# EAGLE design DIY_OpenEVSE_PLUS (EAGLE 6.4)
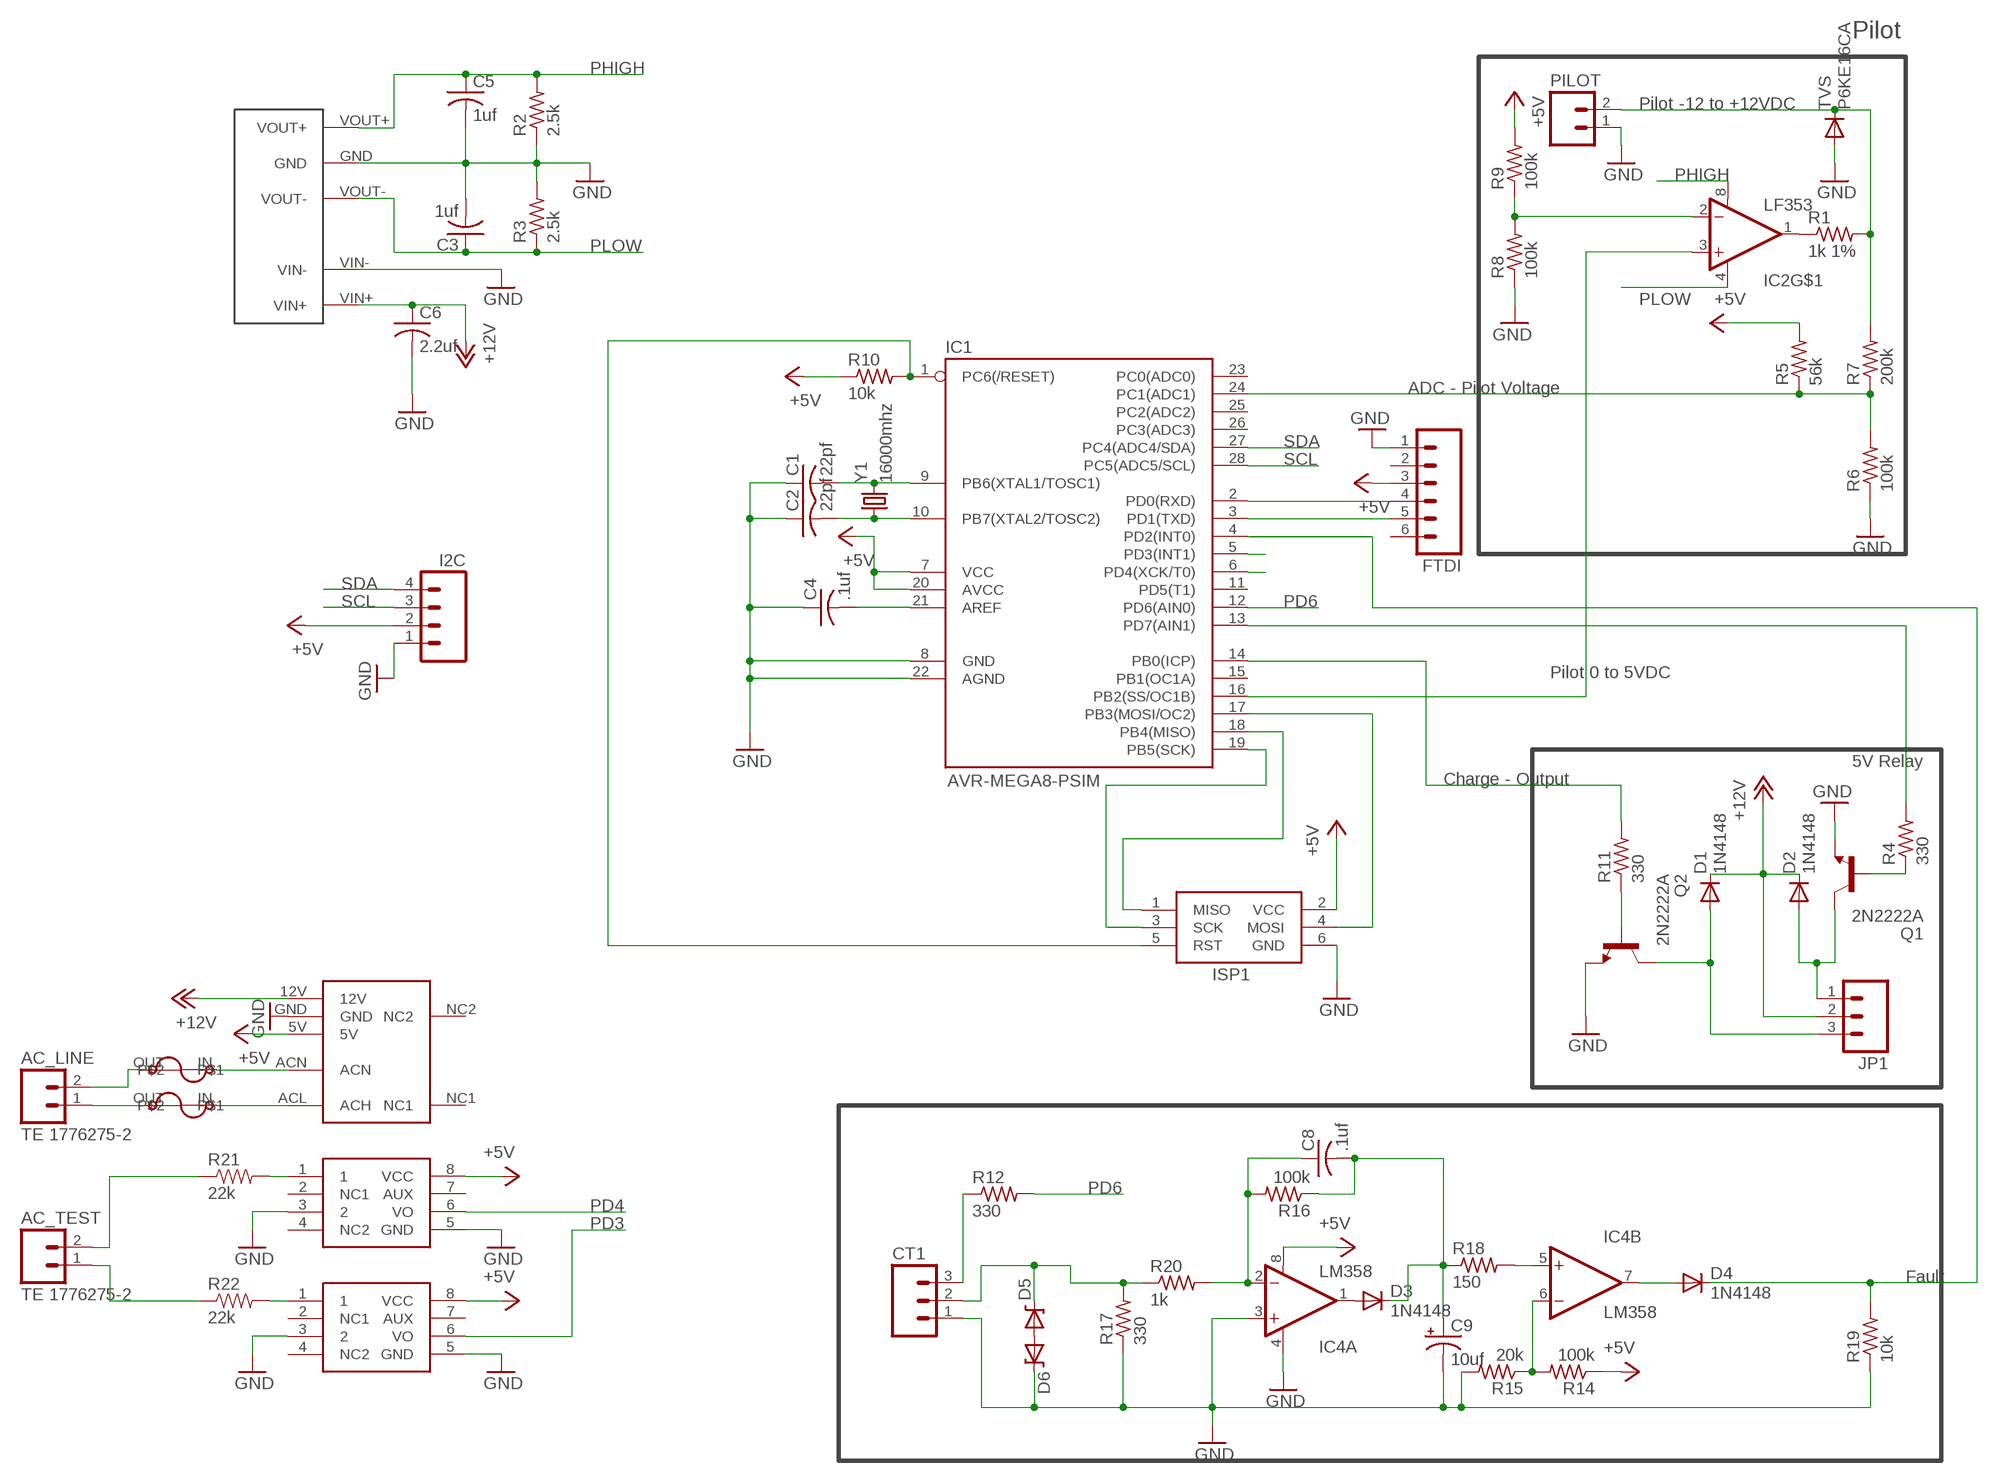
[diagram p0: schematic, sheet 1]

## Parts
AC_LINE  TE 1776275-2  M023.5MM_LOCK  [SCREWTERMINAL-3.5MM-2_LOCK]
AC_TEST  TE 1776275-2  M023.5MM_LOCK  [SCREWTERMINAL-3.5MM-2_LOCK]
C1  22pf  C-US025-024X044  [C025-024X044]
C2  22pf  C-US025-024X044  [C025-024X044]
C3  1uf  C-US025-024X044  [C025-024X044]
C4  .1uf  C-US025-024X044  [C025-024X044]
C5  1uf  C-US025-024X044  [C025-024X044]
C6  2.2uf  C-US025-024X044  [C025-024X044]
C8  .1uf  C-US025-024X044  [C025-024X044]
C9  10uf  CAP_POLPTH2  [CPOL-RADIAL-10UF-25V]
CT1  M03LOCK  [1X03_LOCK]
D1  1N4148  DIODE1N4148  [DIODE-1N4148]
D2  1N4148  DIODE1N4148  [DIODE-1N4148]
D3  1N4148  DIODE1N4148  [DIODE-1N4148]
D4  1N4148  DIODE1N4148  [DIODE-1N4148]
D5  DIODE-ZENERPTH  [DIODE-ZENER]
D6  DIODE-ZENERPTH  [DIODE-ZENER]
DCDC  D107E  DCDC_SIP  [DCDC_SIP]
FTDI  M06LOCK  [1X06_LOCK]
I2C  M04LOCK  [1X04_LOCK]
IC1  AVR-MEGA8-PSIM  [DIL28-3-SIMON]
IC2  LF353  LM358  [DIP08]
IC3  MID400  [DIP08]
IC4  LM358  OPAMP-DUALDIP  [DIP08]
IC5  MID400  [DIP08]
ISP1  AVRISP-6  [AVRISP]
JP1  M03SCREW_LOCK  [SCREWTERMINAL-3.5MM-3_LOCK.007S]
PILOT  M025MM  [SCREWTERMINAL-5MM-2]
Q1  2N2222A  [TO18]
Q2  2N2222A  [TO18]
R1  1k 1%  R-US_0204/7  [0204/7]
R2  2.5k  R-US_0204/7  [0204/7]
R3  2.5k  R-US_0204/7  [0204/7]
R4  330  R-US_0204/7  [0204/7]
R5  56k  R-US_0204/7  [0204/7]
R6  100k  R-US_0204/7  [0204/7]
R7  200k  R-US_0204/7  [0204/7]
R8  100k  R-US_0204/7  [0204/7]
R9  100k  R-US_0204/7  [0204/7]
R10  10k  R-US_0204/7  [0204/7]
R11  330  R-US_0204/7  [0204/7]
R12  330  R-US_0204/7  [0204/7]
R14  100k  R-US_0204/7  [0204/7]
R15  20k  R-US_0204/7  [0204/7]
R16  100k  R-US_0204/7  [0204/7]
R17  330  R-US_0204/7  [0204/7]
R18  150  R-US_0204/7  [0204/7]
R19  10k  R-US_0204/7  [0204/7]
R20  1k  R-US_0204/7  [0204/7]
R21  22k  RESISTORPTH-1/4W  [AXIAL-0.4]
R22  22k  RESISTORPTH-1/4W  [AXIAL-0.4]
TVS  P6KE16CA  DIODEPTH  [DIODE-1N4001]
U$3  BEL1AFUSE  [BELFUSE1A]
U$4  MPM-04E-1205  [MPM-04E-1205]
U$5  BEL1AFUSE  [BELFUSE1A]
Y1  16000mhz  CRYSTALHC49UV  [HC49U-V]

## Nets
+5V: FTDI.3 I2C.2 IC1.7(VCC) IC1.20(AVCC) IC3.8(VCC) IC4.8(A:V+) IC5.8(VCC) ISP1.2(VCC) R5.2 R9.2 R10.1 R14.1 U$4.5V
+12V: C6.1 D1.C D2.C DCDC.VIN+ JP1.2 U$4.12V
GND: C1.1 C2.1 C3.2 C4.1 C5.2 C6.2 C9.2(-) CT1.1 D6.P$1(C) DCDC.GND DCDC.VIN- FTDI.1 I2C.1 IC1.8(GND) IC1.22(AGND) IC3.3 IC3.5(GND) IC4.3(A:+IN) IC4.4(A:V-) IC5.3 IC5.5(GND) ISP1.6(GND) PILOT.1 Q1.1(E) Q2.1(E) R2.1 R3.2 R6.1 R8.1 R15.2 R17.1 R19.1 TVS.A U$4.GND
N$1: AC_LINE.1 U$3.OUT
N$2: Q2.2(B) R11.1
N$3: PILOT.2 R1.2 R7.2 TVS.C
N$4: C1.2 IC1.9(PB6(XTAL1/TOSC1)) Y1.2
N$5: C2.2 IC1.10(PB7(XTAL2/TOSC2)) Y1.1
N$6: AC_LINE.2 U$5.OUT
N$7: C4.2 IC1.21(AREF)
N$8: FTDI.5 IC1.3(PD1(TXD))
N$9: IC3.1 R21.P$2
N$10: IC2.2(-IN) R8.2 R9.1
N$11: IC2.1(OUT) R1.1
N$12: FTDI.4 IC1.2(PD0(RXD))
N$13: D1.A JP1.3 Q2.3(C)
N$14: IC1.17(PB3(MOSI/OC2)) ISP1.4(MOSI)
N$15: IC1.19(PB5(SCK)) ISP1.3(SCK)
N$16: IC1.18(PB4(MISO)) ISP1.1(MISO)
N$17: IC5.1 R22.P$2
N$18: C8.1 IC4.2(A:-IN) R16.2 R20.2
N$19: IC4.5(B:+IN) R18.2
N$20: CT1.2 D5.P$1(C) R17.2 R20.1
N$21: D3.A IC4.1(A:OUT)
N$22: D5.P$2(A) D6.P$2(A)
N$23: C8.2 C9.1(+) D3.C R16.1 R18.1
N$24: IC4.6(B:-IN) R14.2 R15.1
N$25: D4.A IC4.7(B:OUT)
N$26: AC_TEST.2 R21.P$1
N$27: U$3.IN U$4.ACL(ACH)
N$28: D4.C IC1.4(PD2(INT0)) R19.2
N$29: AC_TEST.1 R22.P$1
N$30: U$4.ACN U$5.IN
N$31: Q1.2(B) R4.1
N$32: D2.A JP1.1 Q1.3(C)
N$33: IC1.13(PD7(AIN1)) R4.2
N$34: IC1.14(PB0(ICP)) R11.2
N$35: CT1.3 R12.1
N$53: IC1.24(PC1(ADC1)) R5.1 R6.2 R7.1
PD3: IC1.5(PD3(INT1)) IC5.6(VO)
PD4: IC1.6(PD4(XCK/T0)) IC3.6(VO)
PD6: IC1.12(PD6(AIN0)) R12.2
PHIGH: C5.1 DCDC.VOUT+ IC2.8(V+) R2.2
PLOW: C3.1 DCDC.VOUT- IC2.4(V-) R3.1
RST: IC1.1(PC6(/RESET)) ISP1.5(RST) R10.2
S$2: IC1.16(PB2(SS/OC1B)) IC2.3(+IN)
SCL: I2C.3 IC1.28(PC5(ADC5/SCL))
SDA: I2C.4 IC1.27(PC4(ADC4/SDA))
Unconnected: FTDI.2 FTDI.6 IC1.11(PD5(T1)) IC1.15(PB1(OC1A)) IC1.23(PC0(ADC0)) IC1.25(PC2(ADC2)) IC1.26(PC3(ADC3)) IC2.5(+IN) IC2.6(-IN) IC2.7(OUT) IC3.2(NC1) IC3.4(NC2) IC3.7(AUX) IC5.2(NC1) IC5.4(NC2) IC5.7(AUX) U$4.NC1 U$4.NC2

## Notes on the sheet
- Pilot
- Pilot -12 to +12VDC
- ADC - Pilot Voltage
- Pilot 0 to 5VDC
- 5V Relay
- Charge - Output
- Fault

## Library data of the parts
AC_LINE AC_TEST PILOT = SparkFun:M02: Header 2 Standard 2-pin 0.1" header. Use with straight break away headers (SKU : PRT-00116), right angle break away headers (PRT-00553), swiss pins (PRT-00743), machine pins (PRT-00117), and female headers (PRT-00115). Molex polarized connector foot print use with SKU : PRT-08233 with associated crimp pins and housings.
C1-C6 C8 = adafruit:C-US: CAPACITOR, American symbol
C9 = SparkFun:CAP_POL: Capacitor Polarized These are standard SMD and PTH capacitors. Normally 10uF, 47uF, and 100uF in electrolytic and tantalum varieties. Always verify the external diameter of the through hole cap, it varies with capacity, voltage, and manufacturer. The EIA devices should be standard.
CT1 JP1 = SparkFun:M03: Header 3 Standard 3-pin 0.1" header. Use with straight break away headers (SKU : PRT-00116), right angle break away headers (PRT-00553), swiss pins (PRT-00743), machine pins (PRT-00117), and female headers (PRT-00115). Molex polarized connector foot print use with SKU : PRT-08232 with associated crimp pins and housings.
D1-D4 TVS = SparkFun:DIODE: Diode These are standard reverse protection diodes and small signal diodes. SMA package can handle up to about 1A. SOD-323 can handle about 200mA. What the SOD-323 package when ordering, there are some mfgs out there that are 5-pin packages.
D5 D6 = SparkFun:DIODE-ZENER: Zener Diode Production Part - 8199 3.4V Zener Voltage
DCDC = Qxd:DCDC_SIP
FTDI = SparkFun:M06: Header 6 Standard 6-pin 0.1" header. Use with straight break away headers (SKU : PRT-00116), right angle break away headers (PRT-00553), swiss pins (PRT-00743), machine pins (PRT-00117), and female headers (PRT-00115). Molex polarized connector foot print use with SKU : PRT-08094 with associated crimp pins and housings. NOTES ON THE VARIANTS LOCK and LOCK_LONGPADS... This footprint was designed to help hold the alignment of a through-hole component (i.e. 6-pin header) while soldering it into place. You may notice that each hole has been shifted either up or down by 0.005 of an inch from it's more standard position (which is a perfectly straight line). This slight alteration caused the pins (the squares in the middle) to touch the edges of the holes. Because they are alternating, it causes a "brace" to hold the component in place. 0.005 has proven to be the perfect amount of "off-center" position when using our standard breakaway headers. Although looks a little odd when you look at the bare footprint, once you have a header in there, the alteration is very hard to notice. Also, if you push a header all the way into place, it is covered up entirely on the bottom side. This idea of altering the position of holes to aid alignment will be further integrated into the Sparkfun Library for other footprints. It can help hold any component with 3 or more connection pins.
I2C = SparkFun:M04: Header 4 Standard 4-pin 0.1" header. Use with straight break away headers (SKU : PRT-00116), right angle break away headers (PRT-00553), swiss pins (PRT-00743), machine pins (PRT-00117), and female headers (PRT-00115). Molex polarized connector foot print use with SKU : PRT-08231 with associated crimp pins and housings.
IC1 = SparkFun:AVR-MEGA8-P: MICROCONTROLLER 8 Kbytes FLASH 1 kbytes SRAM 512 bytes EEPROM USART 4-channel 10 bit ADC 2-channel 8 bit ADC
IC2 = SparkFun:LM358
IC3 IC5 = SparkFun:MID400
IC4 = SparkFun:OPAMP-DUAL: Operational Amplifier
ISP1 = adafruit:AVRISP: AVR ISP HEADER Standard 6 pin header for AVR programming
Q1 Q2 = transistor-npn:2N2222*: NPN Transistor
R1-R12 R14-R20 = adafruit:R-US_: RESISTOR, American symbol
R21 R22 = SparkFun:RESISTOR: Resistor Basic schematic elements and footprints for 0603, 1206, and PTH resistors.
U$3 U$5 = Qxd:BEL1AFUSE
U$4 = Qxd:MPM-04E-1205
Y1 = SparkFun:CRYSTAL: Crystals Various standard crystals. Proven footprints. Spark Fun Electronics SKU : COM-00534

## Board
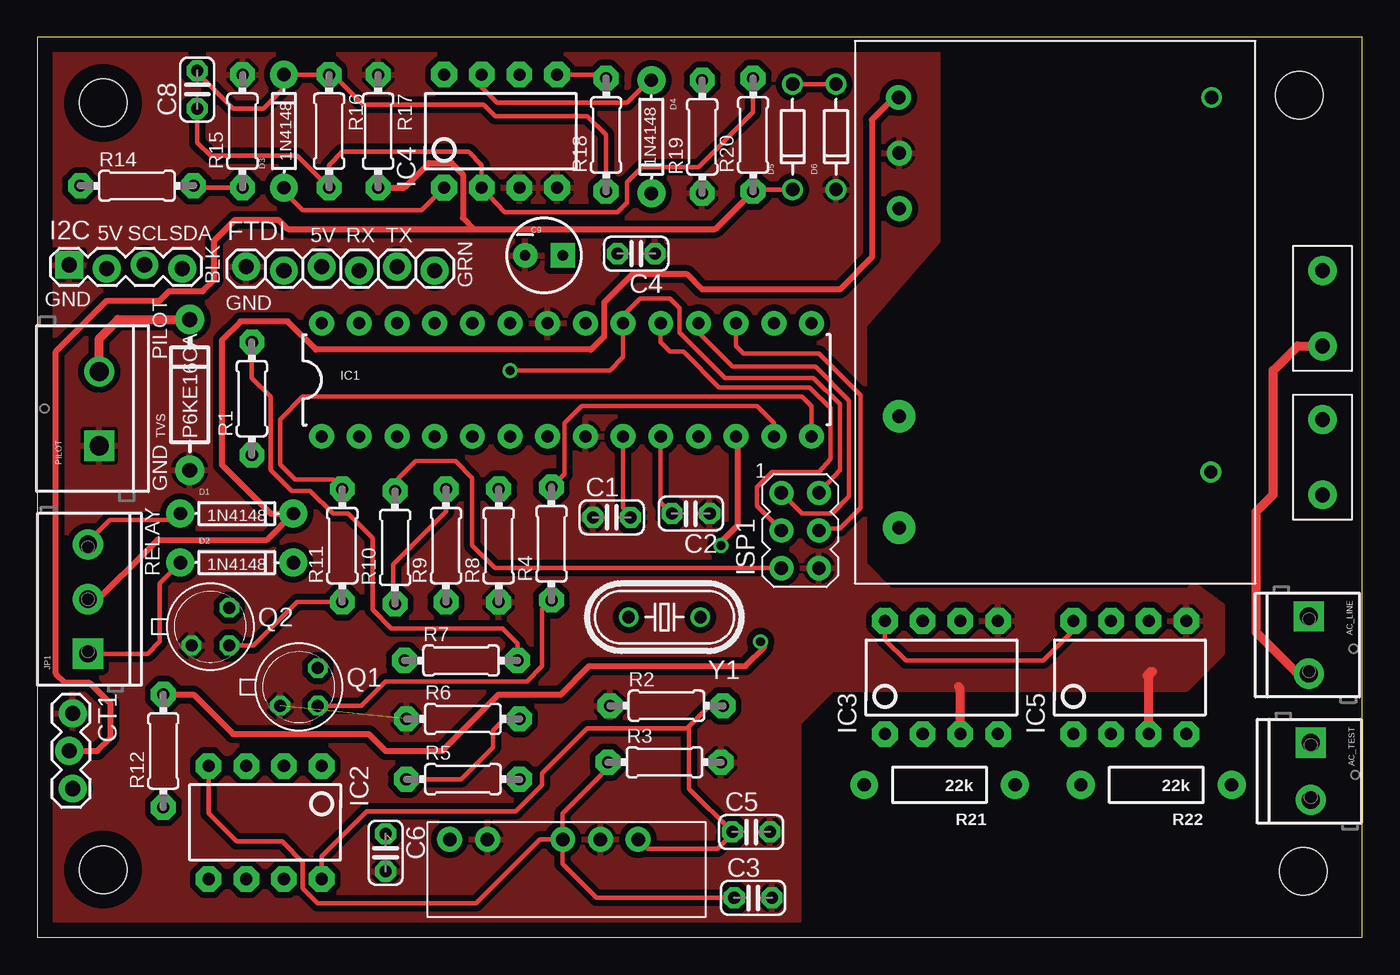
[diagram p1: board, top side]
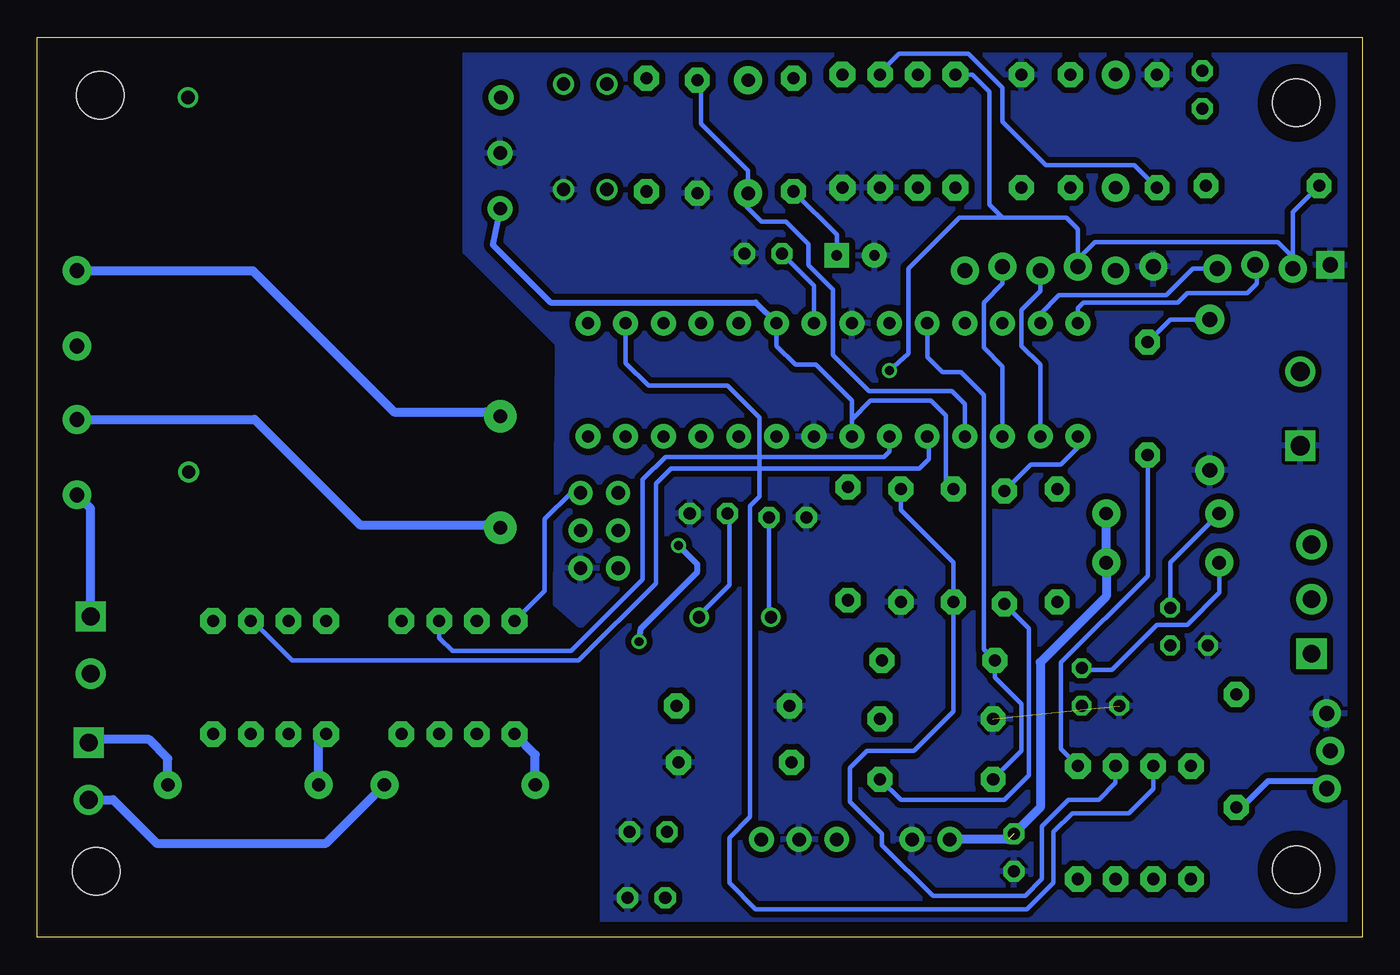
[diagram p2: board, bottom side, seen from below]

Size 89.33 x 60.7 mm. Coordinates in mm from the lower left corner, seen from the top.
Outline: 0,0 89.33,0 89.33,60.7 0,60.7 0,0
Copper layers (1*16): Top 0.035mm / dielectric 1.5mm / Bottom 0.035mm
Design rules "default": minimum track width 10mil, minimum drill 24mil, track to track 8mil, track to pad 8mil, pad to pad 8mil, via to via 8mil, smd to smd 8mil, copper to edge 40mil, drill to drill 8mil, minimum pad ring 10mil, minimum via ring 8mil, stop-mask expansion 4mil, vias tented up to drill 0mil, thermal gap 10mil
Holes 3.2 mm at 4.45,56.26 4.45,4.57 85.34,4.44 85.09,56.77

### Footprints (pad centres in the part's own frame; a part is rotated, then mirrored left to right if it is on the bottom)
SCREWTERMINAL-3.5MM-2_LOCK = drill 1.2 pad 2.032 square: 1 -0.178,0 | drill 1.2 pad 2.032: 2 3.678,0
C025-024X044 = drill 0.813 pad 1.422 octagon: 1 -1.27,0; 2 1.27,0
CPOL-RADIAL-10UF-25V = drill 0.7 pad 1.651 square: 1 1.27,0 | drill 0.7 pad 1.651: 2 -1.27,0
1X03_LOCK = drill 1.016 pad 1.88: 1 0,0.127; 2 2.54,-0.127; 3 5.08,0.127
DIODE-1N4148 = drill 0.9 pad 1.88: A -3.81,0; C 3.81,0
DIODE-ZENER = drill 0.9: P$1 -3.556,0; P$2 3.556,0
DCDC_SIP = drill 0.9 pad 1.676: GND 10.16,0; VIN+ 0,0; VIN- 2.54,0; VOUT+ 12.7,0; VOUT- 7.62,0
1X06_LOCK = drill 1.016 pad 1.88: 1 0,0; 2 2.54,-0.254; 3 5.08,0; 4 7.62,-0.254; 5 10.16,0; 6 12.7,-0.254
1X04_LOCK = drill 1.016 pad 1.88 square: 1 0,0.127 | drill 1.016 pad 1.88: 2 2.54,-0.127; 3 5.08,0.127; 4 7.62,-0.127
DIL28-3-SIMON = drill 0.813 pad 1.676: 1 -16.51,-3.81; 2 -13.97,-3.81; 3 -11.43,-3.81; 4 -8.89,-3.81; 5 -6.35,-3.81; 6 -3.81,-3.81; 7 -1.27,-3.81; 8 1.27,-3.81; 9 3.81,-3.81; 10 6.35,-3.81; 11 8.89,-3.81; 12 11.43,-3.81; 13 13.97,-3.81; 14 16.51,-3.81; 15 16.51,3.81; 16 13.97,3.81; 17 11.43,3.81; 18 8.89,3.81; 19 6.35,3.81; 20 3.81,3.81; 21 1.27,3.81; 22 -1.27,3.81; 23 -3.81,3.81; 24 -6.35,3.81; 25 -8.89,3.81; 26 -11.43,3.81; 27 -13.97,3.81; 28 -16.51,3.81
DIP08 = drill 0.813 pad 1.727 octagon: 1 -3.81,-3.81; 2 -1.27,-3.81; 3 1.27,-3.81; 4 3.81,-3.81; 5 3.81,3.81; 6 1.27,3.81; 7 -1.27,3.81; 8 -3.81,3.81
AVRISP = drill 0.9 pad 1.626: 1 -1.27,2.54; 2 1.27,2.54; 3 -1.27,0; 4 1.27,0; 5 -1.27,-2.54; 6 1.27,-2.54
SCREWTERMINAL-3.5MM-3_LOCK.007S = drill 1.2 pad 2.032 square: 1 -0.178,0 | drill 1.2 pad 2.032: 2 3.5,0; 3 7.178,0
SCREWTERMINAL-5MM-2 = drill 1.3 pad 2.032 square: 1 0,0 | drill 1.3 pad 2.032: 2 5,0
TO18 = drill 0.813 octagon: 1 -1.27,-1.27; 2 1.27,-1.27; 3 1.27,1.27
0204/7 = drill 0.813 pad 1.676 octagon: 1 -3.81,0; 2 3.81,0
AXIAL-0.4 = drill 0.9 pad 1.88: P$1 -5.08,0; P$2 5.08,0
DIODE-1N4001 = drill 1 pad 1.981: A -5.08,0; C 5.08,0
BELFUSE1A = drill 1 pad 1.93: IN 2,1.66; OUT 2,6.74
MPM-04E-1205 = drill 0.9 pad 1.676: 5V 3,25.25; 12V 2.95,32.75; GND 3,29 | drill 0.9 pad 2.184: ACL 3,3.75; ACN 3,11.25 | drill 0.9 pad 1.422: NC1 24,7.5 | drill 0.9: NC2 24.05,32.75
HC49U-V = drill 0.813: 1 -2.413,0; 2 2.413,0

### Placement (x,y rotation side)
AC_LINE  85.72,21.46 270 top
AC_TEST  85.85,12.95 270 top
C1  38.73,28.32 0 top
C2  44.07,28.57 180 top
C3  48.26,2.67 0 top
C4  40.39,46.1 180 top
C5  48.13,7.11 0 top
C6  23.5,5.71 270 top
C8  10.79,57.15 90 top
C9  34.16,45.97 0 top
CT1  2.29,15.11 270 top
D1  13.46,28.57 0 top
D2  13.46,25.27 0 top
D3  16.64,54.36 90 top
D4  41.4,53.98 270 top
D5  50.93,53.98 90 top
D6  53.85,53.98 90 top
DCDC  27.81,6.6 0 top
FTDI  14.1,45.21 0 top
I2C  2.16,45.21 0 top
IC1  35.69,37.59 0 top
IC2  15.37,7.75 180 top
IC3  60.96,17.53 0 top
IC4  31.24,54.36 0 top
IC5  73.66,17.53 0 top
ISP1  51.44,27.43 0 top
JP1  3.43,19.3 90 top
PILOT  4.19,33.15 90 top
Q1  17.65,16.89 0 top
Q2  11.68,20.95 0 top
R1  14.48,36.32 90 top
R2  42.42,15.62 0 top
R3  42.29,11.81 0 top
R4  34.67,26.54 90 top
R5  28.7,10.67 0 top
R6  28.7,14.73 0 top
R7  28.57,18.67 0 top
R8  31.11,26.42 90 top
R9  27.56,26.42 90 top
R10  24.13,26.29 90 top
R11  20.57,26.42 90 top
R12  8.51,12.57 90 top
R14  6.73,50.67 0 top
R15  13.84,54.36 90 top
R16  19.68,54.36 270 top
R17  22.99,54.36 270 top
R18  38.35,54.1 90 top
R19  44.83,53.98 90 top
R20  48.26,54.1 90 top
R21  60.83,10.29 180 top
R22  75.44,10.29 180 top
TVS  10.29,36.58 90 top
U$3  88.65,36.58 180 top
U$4  55.12,23.88 0 top
U$5  88.65,46.61 180 top
Y1  42.29,21.59 180 top

### Tracks (layer width: path | path; a pad name or v marks a point on that pad's centre or on a via)
+5V  (via drill 0.6)
  Top 0.305: IC5.8 69.85,20.7 67.82,18.67 58.55,18.67 57.15,20.07 IC3.8 | ISP1.2 54.1,31.5 54.1,35.94 52.32,37.72 46.35,37.72 43.31,40.77 43.31,42.42 42.67,43.05 40.64,43.05 39.5,41.91 IC1.20 39.5,39.12 38.61,38.23 v31.88,38.23 | R9.2 27.56,28.7 24,25.15 24,22.61 R10.1 24.26,22.48
  Bottom 0.305: IC1.7 34.42,34.93 | 34.42,34.93 34.42,36.2 36.83,38.61 38.23,38.61 39.5,39.88 IC1.20 | R14.1 4.7,48.9 I2C.2 4.7,45.85 5.71,46.86 18.03,46.86 19.18,45.72 | R9.2 28.07,30.73 28.07,35.18 29.08,36.2 33.15,36.2 34.42,34.93 | IC4.8 26.29,58.17 25.15,57.02 25.15,49.4 24.26,48.51 | FTDI.3 19.18,45.72 | 19.18,45.72 19.18,47.75 19.94,48.51 24.26,48.51 | ISP1.2 53.34,29.97 55.12,28.19 55.12,23.37 IC3.8 | R5.2 31.11,9.27 24.13,9.27 22.48,10.92 22.48,20.83 R10.1 | 24.26,48.51 27.18,48.51 30.61,45.09 30.61,39.37 v31.88,38.23
  Bottom 0.406: U$4.5V 58.63,46.69 54.74,42.8 40.89,42.8 IC1.20
+12V  (1 unrouted)
  Top 0.406: U$4.12V 58.02,56.88 56.26,55.12 56.26,45.85 54.1,43.69 44.83,43.69 43.81,44.7 40.13,44.7 38.23,42.8 38.23,40.51 37.34,39.62 18.8,39.62 16.89,41.53 13.72,41.53 12.45,40.26 12.45,31.88 15.75,28.57 D1.C 15.49,26.8 8.13,26.8 3.43,22.1 JP1.2
  Bottom 0.61: C6.1 21.72,8.76 21.72,18.54 17.27,22.99 D2.C D1.C | 23.88,6.6 DCDC.VIN+
GND  (1 unrouted)
  Top 0.61: IC5.3 74.93,17.65 75.18,17.91 75.06,17.91 74.8,17.65 | IC3.3 62.23,16.76 62.1,16.89
  pour Bottom (isolate 0.406): -6.22,-7.11 53.85,-5.59 50.55,-3.3 51.18,-2.67 51.18,19.68 54.36,22.48 54.23,40.01 60.45,46.23 60.45,60.83 54.1,62.61 -5.08,63.5
  pour Top (isolate 0.406): 9.02,-6.1 80.01,-5.97 51.05,-0.89 51.31,-0.64 51.31,14.48 53.59,16.76 77.47,16.76 79.88,19.18 79.88,22.35 77.98,23.75 77.47,23.24 77.34,23.37 57.53,23.37 55.75,25.15 55.75,41.28 60.71,46.99 60.71,65.15 60.45,64.64 57.91,85.34 -0.25,82.17 -0.25,-14.35
N$1
  Bottom 0.61: AC_LINE.1 85.72,28.91 U$3.OUT
N$2
  Top 0.305: R11.1 17.53,22.61 14.61,19.68 Q2.2
N$3
  Top 0.305: R7.2 32.38,19.81 31.37,20.83 23.88,20.83 22.61,22.1 22.61,26.92 20.95,28.57 19.94,28.57 18.41,30.1 17.14,30.1 15.75,31.5 15.75,36.45 14.48,37.72 R1.2
  Top 0.61: PILOT.2 4.19,40.39 5.46,41.66 TVS.C
  Bottom 0.305: R1.2 12.95,41.66 11.3,41.66 11.18,41.53 10.41,41.53 TVS.C
N$4
  Top 0.305: IC1.9 39.5,28.96 C1.2
  Bottom 0.305: C1.2 40.01,21.72 Y1.2
N$5
  Top 0.305: IC1.10 42.04,29.34 C2.2
  Bottom 0.305: Y1.1 44.7,21.72 42.67,23.75 42.67,28.45 C2.2
N$6
  Top 0.61: AC_LINE.2 84.96,17.79 82.17,20.57 82.17,28.7 83.31,29.84 83.31,38.23 84.96,39.88 86.64,39.88 U$5.OUT
N$7
  Bottom 0.305: IC1.21 36.96,43.94 C4.2
N$8
  Bottom 0.305: FTDI.5 24.26,44.07 25.53,42.8 25.53,39.75 24.26,38.48 IC1.3
N$9
  Bottom 0.61: R21.P$2 55.75,12.32 IC3.1
N$10
  Bottom 0.305: R8.2 31.11,28.83 27.56,25.27 R9.1 27.56,15.24 30.23,12.57 33.4,12.57 34.54,11.43 34.54,9.14 32.38,6.98 32.38,6.22 28.96,2.79 22.73,2.79 21.59,3.94 21.59,7.49 19.81,9.27 17.78,9.27 16.64,10.41 IC2.2
N$11
  Bottom 0.305: R1.1 14.48,24.38 20.32,18.54 20.32,12.7 IC2.1
N$12
  Bottom 0.305: FTDI.4 21.72,43.56 22.99,42.29 22.99,39.88 21.72,38.61 IC1.2
N$13
  Top 0.305: D1.A 9.21,28.13 4.89,28.13 3.43,26.67 JP1.3
  Bottom 0.305: Q2.3 12.95,25.27 D1.A
N$14
  Top 0.305: IC1.17 47.12,39.88 47.62,39.37 52.7,39.37 55.5,36.58 55.5,28.96 54.1,27.56 52.83,27.56 ISP1.4
N$15
  Top 0.305: IC1.19 42.04,40.13 42.67,39.5 43.56,39.5 45.97,37.08 52.07,37.08 53.47,35.69 53.47,32.26 52.7,31.37 49.53,31.37 48.51,30.35 48.51,29.08 ISP1.3
N$16
  Top 0.305: IC1.18 44.58,40.77 46.86,38.48 52.45,38.48 54.74,36.2 54.74,29.72 53.59,28.57 51.56,28.57 ISP1.1
N$17
  Bottom 0.61: R22.P$2 70.36,13.21 IC5.1
N$18
  Top 0.305: C8.1 10.79,53.59 11.68,52.71 17.53,52.71 R16.2 19.68,52.07 20.57,52.96 29.08,52.96 29.97,52.07 IC4.2 31.5,48.9 39.12,48.9 39.75,49.53 39.75,50.93 40.77,51.94 44.58,51.94 48.26,55.63 R20.2
N$19
  Top 0.305: IC4.5 38.1,58.17 R18.2
N$20
  Top 0.305: 51.36,50.37 D5.P$1 48.39,50.42
  Top 0.406: 48.39,50.42 R20.1 45.72,47.75 29.46,47.75 | CT1.2 4.06,12.57 4.95,13.46 4.95,15.75 3.56,17.14 1.91,17.14 1.27,17.78 1.27,39.5 4.7,42.93 8.26,42.93 8.89,43.56 11.18,43.56 11.94,44.32 11.94,46.99 13.34,48.39 16.26,48.39 16.89,47.75 29.46,47.75 | R17.2 24.77,50.55 26.42,52.2 27.94,52.2 28.7,51.44 28.7,48.51 29.46,47.75
N$21
  Top 0.305: D3.A 16.64,50.29 17.91,49.02 25.91,49.02 IC4.1
N$22
  Top 0.305: D5.P$2 D6.P$2
N$23
  Top 0.305: C8.2 10.79,58.29 13.21,55.88 15.24,55.88 16.64,57.28 D3.C R16.1 19.94,58.17 21.97,56.13 30.1,56.13 30.86,55.37 37.08,55.37 38.35,54.1 R18.1
  Bottom 0.305: C9.1 35.43,47.37 R18.1
N$24
  Top 0.305: R15.1 10.67,50.55 R14.2
  Bottom 0.305: IC4.6 32.51,58.29 31.24,59.56 26.54,59.56 24.26,57.28 24.26,54.99 21.34,52.07 15.37,52.07 R15.1
N$25
  Top 0.305: D4.A 41.27,57.79 39.75,56.26 30.99,56.26 29.84,57.4 29.84,58.04 IC4.7
N$26
  Bottom 0.61: AC_TEST.2 84.21,9.28 81.28,6.35 69.85,6.35 R21.P$1
N$27
  Bottom 0.61: U$3.IN 74.67,34.92 67.56,27.81 59.07,27.81 U$4.ACL
N$28
  Bottom 0.305: IC1.4 26.8,35.94 27.69,36.83 33.27,36.83 35.69,39.24 35.69,43.69 37.34,45.34 37.34,46.74 38.86,48.26 40.51,48.26 41.53,49.28 41.53,50.04 D4.C 41.4,51.69 44.58,54.86 44.58,57.53 R19.2
N$29
  Bottom 0.61: R22.P$1 80.52,12.07 81.79,13.34 85.65,13.34 AC_TEST.1
N$30
  Bottom 0.61: U$5.IN 74.79,44.95 65.28,35.43 59.06,35.43 U$4.ACN
N$31
  Top 0.305: Q1.2 21.84,15.62 23.5,17.27 33.02,17.27 34.04,18.29 34.04,22.1 R4.1
N$32
  Top 0.305: JP1.1 7.44,19.13 8.26,19.94 8.26,23.88 D2.A
  Bottom 0.305: D2.A 9.65,23.24 11.81,21.08 13.84,21.08 16.89,18.03 18.8,18.03 Q1.3
N$33
  Top 0.305: IC1.13 49.66,34.67 48.51,35.81 36.7,35.81 35.56,34.67 35.56,31.24 R4.2
N$34
  Top 0.305: IC1.14 52.2,35.81 51.56,36.45 17.91,36.45 16.38,34.93 16.38,31.88 17.4,30.86 19.94,30.86 R11.2
N$35
  Bottom 0.406: R12.1 8.13,8.76 6.35,10.54 2.92,10.54 CT1.3
N$53
  Top 0.305: R5.1 28.57,10.67 30.73,12.83 30.73,13.97 31.5,14.73 R6.2
  Bottom 0.305: IC1.24 29.34,39.12 28.32,38.1 27.05,38.1 25.53,36.58 25.53,19.43 R7.1 24.77,17.53 22.99,15.75 22.99,12.57 R5.1
PD3
  Bottom 0.305: IC5.6 74.8,21.34 72.14,18.67 52.83,18.67 47.62,23.88 47.62,30.61 46.61,31.62 29.84,31.62 29.21,32.26 29.21,33.66 IC1.5
PD4
  Bottom 0.305: IC3.6 62.23,20.19 61.34,19.3 53.34,19.3 48.51,24.13 48.51,30.86 46.99,32.39 32.26,32.39 31.88,32.77 IC1.6
PD6  (via drill 0.6)
  Top 0.406: R12.2 10.54,16.38 13.21,13.72 22.35,13.72 23.5,12.57 27.3,12.57 31.11,16.38 35.31,16.38 37.21,18.29 47.75,18.29 49.02,19.56 v48.77,19.94 | v46.1,26.42 46.1,26.67 47.24,27.81 47.24,33.66 IC1.12
  Bottom 0.406: v48.77,19.94 48.64,20.83 44.83,24.64 44.83,25.15 v46.1,26.42
PHIGH
  Top 0.305: R2.2 45.34,15.62 43.94,14.22 | 43.94,14.22 43.94,10.03 C5.1 46.86,6.98 45.85,5.97 41.15,5.97 DCDC.VOUT+ | IC2.8 19.18,5.46 22.23,8.51 32.26,8.51 34.04,10.29 34.04,11.05 37.08,14.1 43.81,14.1 43.94,14.22
PLOW
  Top 0.305: DCDC.VOUT- 35.43,4.95 37.72,2.67 C3.1 | DCDC.VOUT- 35.43,8.38 38.35,11.3 R3.1 | IC2.4 11.56,8.38 13.46,6.48 16.51,6.48 17.91,5.08 17.91,3.3 18.92,2.29 29.59,2.29 33.91,6.6 DCDC.VOUT-
RST
  Top 0.305: ISP1.5 30.86,24.89 29.34,26.42 29.34,30.99 28.19,32.13 25.53,32.13 24.38,30.99 24.38,30.35 R10.2
  Bottom 0.305: IC1.1 19.18,33.02 20.32,31.88 22.35,31.88 R10.2
S$2
  Bottom 0.305: IC1.16 49.66,38.73 48.13,37.21 42.8,37.21 40.64,35.05 40.64,29.72 41.27,29.08 41.27,8.13 42.67,6.73 42.67,3.68 40.89,1.91 22.61,1.91 20.83,3.68 20.83,7.11 19.56,8.38 15.75,8.38 14.1,10.03 IC2.3
SCL
  Bottom 0.305: IC1.28 19.18,42.42 18.8,42.8 12.45,42.8 11.81,43.43 7.75,43.43 7.11,44.07 7.11,45.21 I2C.3
SDA
  Bottom 0.305: IC1.27 21.72,42.04 20.45,43.31 13.21,43.31 11.43,45.09 I2C.4

### Text on the board
tNames: 5V | SCL | SDA | 5V | RX | TX | BLK | GRN | GND | GND | PILOT | GND | RELAY